# EAGLE design USB DigiVOX Interface (EAGLE 5.11)
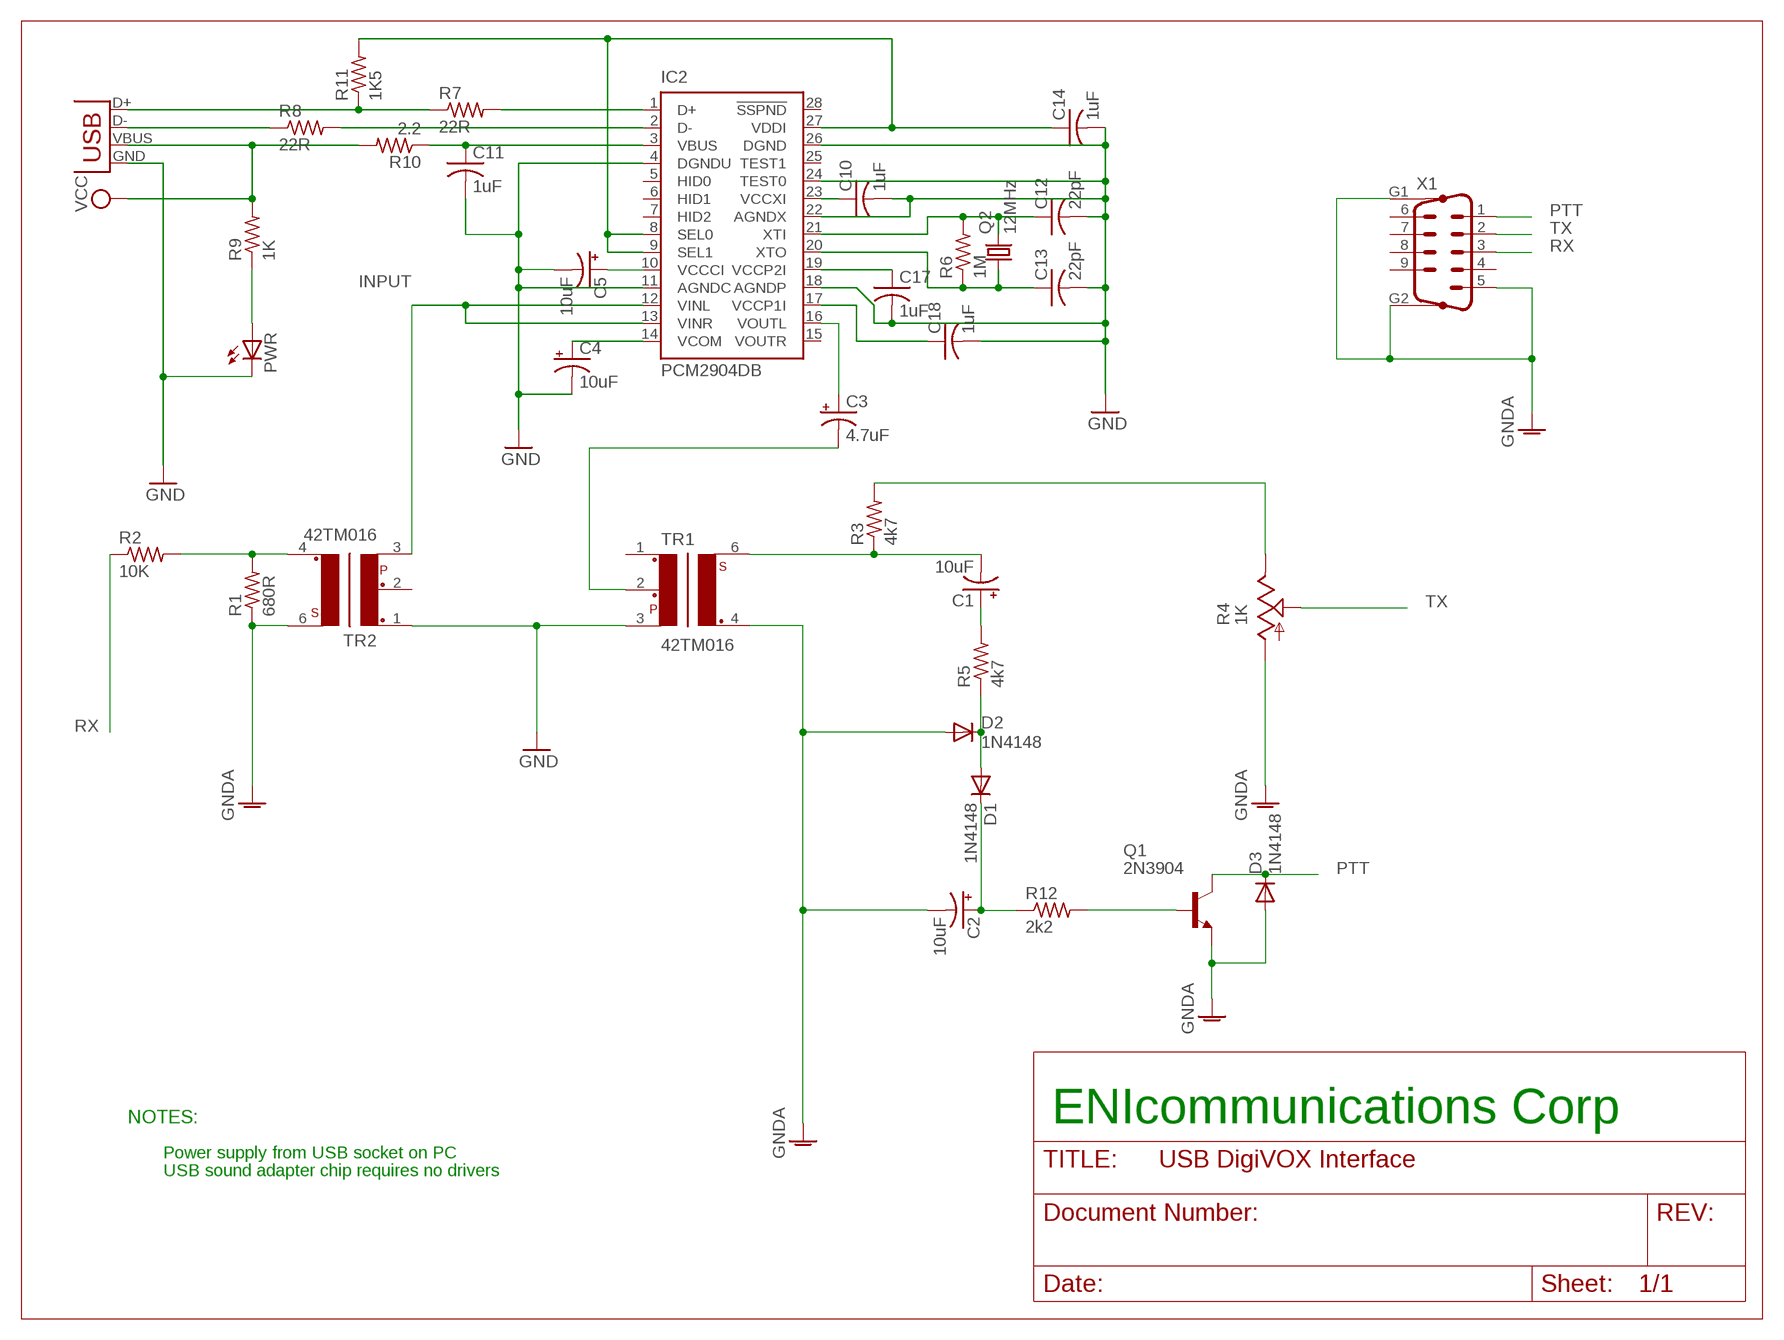
[diagram p0: schematic, sheet 1]

## Parts
C1  10uF  CAP_POLPTH2  [CPOL-RADIAL-10UF-25V]
C2  10uF  CAP_POLPTH2  [CPOL-RADIAL-10UF-25V]
C3  4.7uF  CAP_POLPTH2  [CPOL-RADIAL-10UF-25V]
C4  10uF  CAP_POLPTH2  [CPOL-RADIAL-10UF-25V]
C5  10uF  CAP_POLPTH2  [CPOL-RADIAL-10UF-25V]
C10  1uF  C-US025-025X050  [C025-025X050]
C11  1uF  C-US025-025X050  [C025-025X050]
C12  22pF  C-US025-025X050  [C025-025X050]
C13  22pF  C-US025-025X050  [C025-025X050]
C14  1uF  C-US025-025X050  [C025-025X050]
C17  1uF  C-US025-025X050  [C025-025X050]
C18  1uF  C-US025-025X050  [C025-025X050]
D1  1N4148  [DO35-10]
D2  1N4148  [DO35-10]
D3  1N4148  [DO35-10]
IC2  PCM2904DB  [SSOP28DB]
PWR  LED3MM  [LED3MM]
Q1  2N3904  [TO92]
Q2  12MHz  CRYSTALHC49S  [HC49/S]
R1  680R  R-US_0207/2V  [0207/2V]
R2  10K  R-US_0207/2V  [0207/2V]
R3  4k7  R-US_0207/2V  [0207/2V]
R4  1K  TRIM_US-CA6V  [CA6V]
R5  4k7  R-US_0207/2V  [0207/2V]
R6  1M  R-US_0207/2V  [0207/2V]
R7  22R  R-US_0207/2V  [0207/2V]
R8  22R  R-US_0207/2V  [0207/2V]
R9  1K  R-US_0207/2V  [0207/2V]
R10  2.2  R-US_0207/2V  [0207/2V]
R11  1K5  R-US_0207/2V  [0207/2V]
R12  2k2  R-US_0207/2V  [0207/2V]
TR1  42TM016  42TM113  [42TM]
TR2  42TM016  42TM113  [42TM]
X1  M09HP  [M09HP]
X2  USBSMD  [USB-MINIB]

## Nets
GND: C4.2(-) C5.2(-) C10.2 C11.2 C12.2 C13.2 C14.2 C17.2 C18.2 IC2.4(DGNDU) IC2.11(AGNDC) IC2.18(AGNDP) IC2.22(AGNDX) IC2.24(TEST0) IC2.26(DGND) PWR.K(C) TR1.3 TR2.1 X2.GND
GNDA: C2.2(-) D2.A D3.A Q1.3(E) R1.1 R4.A TR1.4 TR2.6 X1.5 X1.G1 X1.G2
INPUT: IC2.12(VINL) IC2.13(VINR) TR2.3
N$1: C3.1(+) IC2.16(VOUTL)
N$2: C1.2(-) R3.1 TR1.6
N$3: C5.1(+) IC2.10(VCCCI)
N$4: C12.1 IC2.21(XTI) Q2.2 R6.2
N$5: PWR.A R9.1
N$6: C13.1 IC2.20(XTO) Q2.1 R6.1
N$7: C10.1 IC2.23(VCCXI)
N$8: R1.2 R2.2 TR2.4
N$9: C4.1(+) IC2.14(VCOM)
N$11: C1.1(+) R5.2
N$12: D1.A D2.C R5.1
N$13: C14.1 IC2.8(SEL0) IC2.9(SEL1) IC2.27(VDDI) R11.2
N$14: C3.2(-) TR1.2
N$15: C11.1 IC2.3(VBUS) R10.1
N$16: Q1.2(B) R12.2
N$17: R3.2 R4.E
N$18: C17.1 IC2.19(VCCP2I)
N$19: R7.1 R11.1 X2.D+
N$20: IC2.2(D-) R8.2
N$21: IC2.1(D+) R7.2
N$22: R8.1 X2.D-
N$24: C2.1(+) D1.C R12.1
N$26: C18.1 IC2.17(VCCP1I)
PTT: D3.C Q1.1(C) X1.1
RX: R2.1 X1.3
TX: R4.S X1.2
VCC: R9.2 R10.2 X2.VBUS
Unconnected: IC2.5(HID0) IC2.6(HID1) IC2.7(HID2) IC2.15(VOUTR) IC2.25(TEST1) IC2.28(!SSPND) TR1.1 TR2.2 X1.4 X1.6 X1.7 X1.8 X1.9

## Notes on the sheet
- NOTES: | ENIcommunications Corp
- Power supply from USB socket on PC
- USB sound adapter chip requires no drivers

## Library data of the parts
C1-C5 = SparkFun:CAP_POL: Capacitor Polarized These are standard SMD and PTH capacitors. Normally 10uF, 47uF, and 100uF in electrolytic and tantalum varieties. Always verify the external diameter of the through hole cap, it varies with capacity, voltage, and manufacturer. The EIA devices should be standard.
C10-C14 C17 C18 = rcl:C-US: CAPACITOR, American symbol
D1-D3 = diode:1N4148: DIODE high speed (Philips)
IC2 = texas:PCM29*: STEREO AUDIO CODEC WITH USB INTERFACE SINGLE-ENDED ANALOG INPUT/OUTPUT AND S/PDIF
PWR = led:LED: LED OSRAM: - CHIPLED LG R971, LG N971, LY N971, LG Q971, LY Q971, LO R971, LY R971 LH N974, LH R974 LS Q976, LO Q976, LY Q976 LO Q996 - Hyper CHIPLED LW Q18S LB Q993, LB Q99A, LB R99A - SideLED LS A670, LO A670, LY A670, LG A670, LP A670 LB A673, LV A673, LT A673, LW A673 LH A674 LY A675 LS A676, LA A676, LO A676, LY A676, LW A676 LS A679, LY A679, LG A679 - Hyper Micro SIDELED® LS Y876, LA Y876, LO Y876, LY Y876 LT Y87S - SmartLED LW L88C, LW L88S LB L89C, LB L89S, LG L890 LS L89K, LO L89K, LY L89K LS L896, LA L896, LO L896, LY L896 - TOPLED LS T670, LO T670, LY T670, LG T670, LP T670 LSG T670, LSP T670, LSY T670, LOP T670, LYG T670 LG T671, LOG T671, LSG T671 LB T673, LV T673, LT T673, LW T673 LH T674 LS T676, LA T676, LO T676, LY T676, LB T676, LH T676, LSB T676, LW T676 LB T67C, LV T67C, LT T67C, LS T67K, LO T67K, LY T67K, LW E67C LS E67B, LA E67B, LO E67B, LY E67B, LB E67C, LV E67C, LT E67C LW T67C LS T679, LY T679, LG T679 LS T770, LO T770, LY T770, LG T770, LP T770 LB T773, LV T773, LT T773, LW T773 LH T774 LS E675, LA E675, LY E675, LS T675 LS T776, LA T776, LO T776, LY T776, LB T776 LHGB T686 LT T68C, LB T68C - Hyper Mini TOPLED® LB M676 - Mini TOPLED Santana® LG M470 LS M47K, LO M47K, LY M47K Source: http://www.osram.convergy.de LUXEON: - LUMILED® LXK2-PW12-R00, LXK2-PW12-S00, LXK2-PW14-U00, LXK2-PW14-V00 LXK2-PM12-R00, LXK2-PM12-S00, LXK2-PM14-U00 LXK2-PE12-Q00, LXK2-PE12-R00, LXK2-PE12-S00, LXK2-PE14-T00, LXK2-PE14-U00 LXK2-PB12-K00, LXK2-PB12-L00, LXK2-PB12-M00, LXK2-PB14-N00, LXK2-PB14-P00, LXK2-PB14-Q00 LXK2-PR12-L00, LXK2-PR12-M00, LXK2-PR14-Q00, LXK2-PR14-R00 LXK2-PD12-Q00, LXK2-PD12-R00, LXK2-PD12-S00 LXK2-PH12-R00, LXK2-PH12-S00 LXK2-PL12-P00, LXK2-PL12-Q00, LXK2-PL12-R00 Source: www.luxeon.com KINGBRIGHT: KA-3528ASYC Source: www.kingbright.com
Q1 = transistor-npn:2N3904: NPN Transistor
Q2 = crystal:CRYSTAL: CRYSTAL
R1-R3 R5-R12 = resistor:R-US_: RESISTOR, American symbol
R4 = pot:TRIM_US-: POTENTIOMETER
TR1 TR2 = trafo-xicon:42TM113: Transformer Mouser 42TLM Series Source: http://www.mouser.com/catalog/specsheets/164267.pdf
X1 = con-subd:M09HP: SUB-D
X2 = SparkFun:USB: USB Connectors USB-B-PTH is fully proven SKU : PRT-00139 USB-miniB is fully proven SKU : PRT-00587 USB-A-PCB is untested. USB-A-H is throughly reviewed, but untested. Spark Fun Electronics SKU : PRT-00437 USB-B-SMT is throughly reviewed, but untested. Needs silkscreen touching up. USB-A-S has not been used/tested USB-MB-H has not been used/tested

## Board
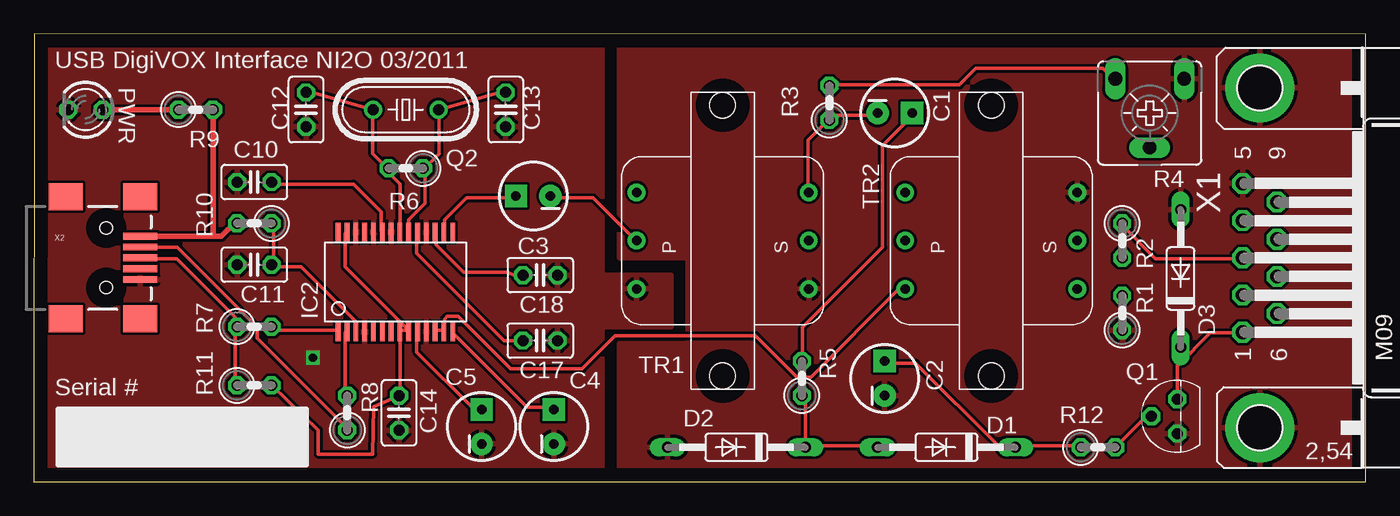
[diagram p1: board, top side]
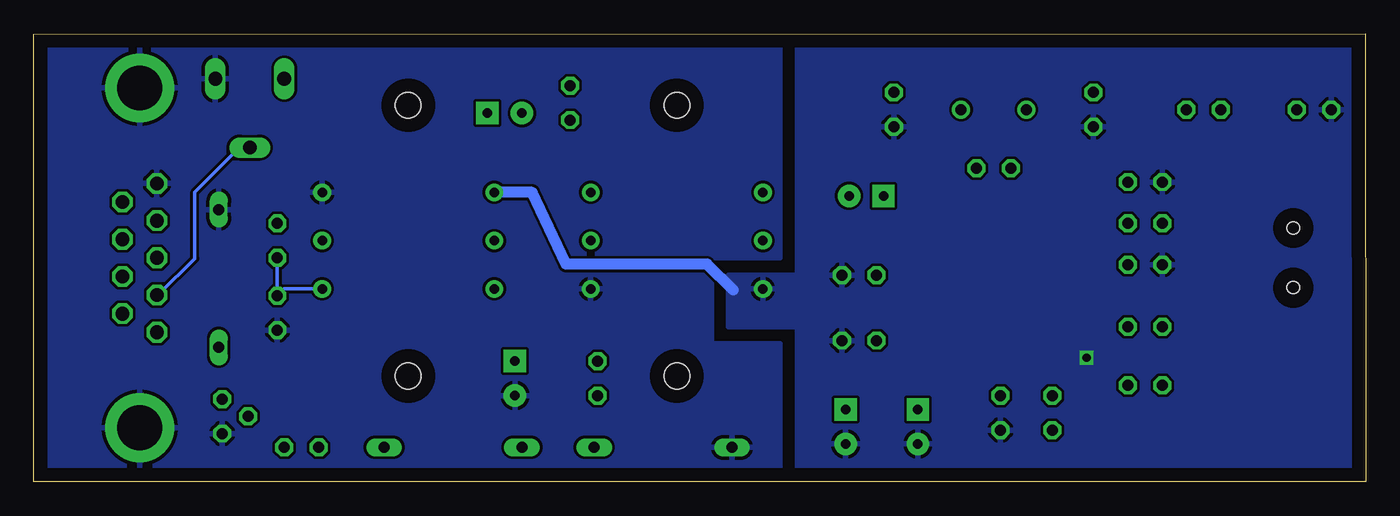
[diagram p2: board, bottom side, seen from below]

Size 98.22 x 33.02 mm. Coordinates in mm from the lower left corner, seen from the top.
Outline: 0,0 98.22,0 98.22,33.01 0.01,33.02 0,0
Copper layers (1*16): Top 0.035mm / dielectric 1.5mm / Bottom 0.035mm
Design rules "default": minimum track width 10mil, minimum drill 24mil, track to track 8mil, track to pad 8mil, pad to pad 8mil, via to via 8mil, smd to smd 8mil, copper to edge 40mil, drill to drill 8mil, minimum pad ring 10mil, minimum via ring 8mil, stop-mask expansion 4mil, vias tented up to drill 0mil, thermal gap 10mil

### Footprints (pad centres in the part's own frame; a part is rotated, then mirrored left to right if it is on the bottom)
CPOL-RADIAL-10UF-25V = drill 0.7 pad 1.651 square: 1 1.27,0 | drill 0.7 pad 1.651: 2 -1.27,0
C025-025X050 = drill 0.813 octagon: 1 -1.27,0; 2 1.27,0
DO35-10 = drill 0.813 long: A 5.08,0; C -5.08,0
SSOP28DB = smd 0.348 x 1.397: 1 -4.225,-3.656; 2 -3.575,-3.656; 3 -2.925,-3.656; 4 -2.275,-3.656; 5 -1.625,-3.656; 6 -0.975,-3.656; 7 -0.325,-3.656; 8 0.325,-3.656; 9 0.975,-3.656; 10 1.625,-3.656; 11 2.275,-3.656; 12 2.925,-3.656; 13 3.575,-3.656; 14 4.225,-3.656; 15 4.225,3.656; 16 3.575,3.656; 17 2.925,3.656; 18 2.275,3.656; 19 1.625,3.656; 20 0.975,3.656; 21 0.325,3.656; 22 -0.325,3.656; 23 -0.975,3.656; 24 -1.625,3.656; 25 -2.275,3.656; 26 -2.925,3.656; 27 -3.575,3.656; 28 -4.225,3.656
LED3MM = drill 0.813 octagon: A -1.27,0; K 1.27,0
TO92 = drill 0.813 octagon: 1 1.27,0; 2 0,1.905; 3 -1.27,0
HC49/S = drill 0.813: 1 -2.413,0; 2 2.413,0
0207/2V = drill 0.813 octagon: 1 -1.27,0; 2 1.27,0
CA6V = drill 1.016 long: A -2.54,-2.54; E 2.54,-2.54; S 0,2.54
42TM = drill 0.7 pad 1.3: 1 -3.556,-6.35; 2 0,-6.35; 3 3.556,-6.35; 4 3.556,6.35; 5 0,6.35; 6 -3.556,6.35 | hole 1.9: -9.982,0; 9.982,0
M09HP = drill 1.016 octagon: 1 -5.486,1.27; 2 -2.743,1.27; 3 0,1.27; 4 2.743,1.27; 5 5.486,1.27; 6 -4.115,-1.27; 7 -1.372,-1.27; 8 1.372,-1.27; 9 4.115,-1.27 | drill 3.302 pad 5.08: G1 -12.522,0; G2 12.522,0
USB-MINIB = smd 2.5 x 0.5: D+ 2.5,0; D- 2.5,0.8; GND 2.5,-1.6; ID 2.5,-0.8; VBUS 2.5,1.6 | smd 2.5 x 2: GND@1 -3,-4.5; GND@2 -3,4.5; GND@3 2.5,4.5; GND@4 2.5,-4.5 | hole 0.9: 0,2.2; 0,-2.2

### Placement (x,y rotation side)
C1  63.5,27.18 0 top
C2  62.74,7.62 90 top
C3  36.83,21.08 180 top
C4  38.35,4.06 90 top
C5  33.02,4.06 90 top
C10  16.26,22.1 180 top
C11  16.26,16 180 top
C12  20.07,27.43 270 top
C13  34.8,27.43 270 top
C14  26.92,5.08 270 top
C17  37.34,10.41 0 top
C18  37.34,15.24 0 top
D1  67.31,2.54 180 top
D2  51.82,2.54 180 top
D3  84.58,14.99 90 top
IC2  26.67,14.73 0 top
PWR  3.81,27.43 180 top
Q1  84.33,4.83 90 top
Q2  27.43,27.43 180 top
R1  80.26,12.45 90 top
R2  80.26,17.78 270 top
R3  58.67,27.94 90 top
R4  82.3,27.18 180 top
R5  56.64,7.62 90 top
R6  27.43,23.11 180 top
R7  16.26,11.43 0 top
R8  23.11,5.08 90 top
R9  11.94,27.43 0 top
R10  16.26,19.05 180 top
R11  16.26,7.11 0 top
R12  78.49,2.54 0 top
TR1  50.8,17.78 270 top
TR2  70.61,17.78 270 top
X1  90.42,16.51 90 top
X2  5.33,16.51 0 top

### Tracks (layer width: path | path; a pad name or v marks a point on that pad's centre or on a via)
GND  (via drill 0.6)
  Bottom 0.254: 46.99,14.63 46.63,14.12
  Bottom 0.813: 46.63,14.12 48.56,16.05 58.98,16.05 61.47,21.34 TR2.1
  other vias: 20.57,9.14
  pour Bottom: 0,0 41.91,0 41.91,11.43 46.99,11.43 46.99,15.24 41.91,15.24 41.91,33.02 0,33.02
  pour Top: 0,0 41.91,0 41.91,11.43 46.99,11.43 46.99,15.24 41.91,15.24 41.91,33.02 0,33.02
GNDA
  pour Bottom: 43.18,0 43.18,10.16 48.26,10.16 48.26,16.51 43.18,16.51 43.18,33.02 98.3,33.02 98.3,0
  pour Top: 43.18,0 43.18,10.16 48.26,10.16 48.26,16.51 43.18,16.51 43.18,33.02 98.3,33.02 98.3,0
INPUT
  Top 0.254: IC2.12 29.67,11.18 30.07,11.18 IC2.13 30.28,11.18 30.28,11.99 30.48,12.19 31.29,12.19 35.15,8.33 40.44,8.33 42.88,10.77 53.24,10.77 56.29,7.72 57.3,7.72 63.8,14.22 TR2.3
N$1
  Top 0.254: IC2.16 30.28,18.49 30.28,19.3 31.9,20.93 35.56,20.93 C3.1
N$2
  Top 0.254: TR1.6 57.1,21.34 57.1,25.2 58.52,26.62 R3.1 58.73,26.82 58.93,27.03 62.18,27.03 C1.2
N$3
  Top 0.254: IC2.10 28.25,10.97 28.25,9.55 32.31,5.49 32.92,5.49 C5.1
N$4
  Top 0.254: IC2.21 27.03,18.49 27.03,21.95 26.01,22.96 R6.2 26.01,23.16 24.99,24.18 24.99,27.43 | 24.99,27.43 Q2.2 | 24.99,27.43 20.73,28.65 20.12,28.65 C12.1
N$5
  Top 0.406: PWR.A R9.1
N$6
  Top 0.254: IC2.20 27.64,18.49 27.64,19.3 28.85,20.52 28.85,22.96 R6.1 28.85,23.16 29.87,24.18 29.87,27.43 | 29.87,27.43 Q2.1 | 29.87,27.43 34.14,28.65 34.75,28.65 C13.1
N$7
  Top 0.254: IC2.23 25.6,18.49 25.6,19.91 23.57,21.95 17.68,21.95 C10.1
N$8
  Bottom 0.254: R2.2 R1.2 79.76,14.22 TR2.4
N$9
  Top 0.254: IC2.14 30.89,10.97 36.37,5.49 38.2,5.49 C4.1
N$11
  Top 0.254: R5.2 56.69,8.94 56.69,11.38 62.59,17.27 62.59,24.79 64.82,27.03 C1.1
N$12
  Top 0.254: 56.9,2.64 56.9,6.1 R5.1 | 56.9,2.64 62.18,2.64 D1.A | D2.C 56.9,2.64
N$13
  Top 0.254: 27.64,11.18 27.03,11.18 IC2.8 27.03,10.97 27.03,6.5 C14.1 25.04,5.54 24.99,2.03 20.98,2.03 20.98,3.81 R11.2 | 27.64,11.18 22.96,15.85 22.96,18.29 IC2.27 | 27.64,11.18 IC2.9
N$14
  Top 0.254: TR1.2 44.3,17.88 41.25,20.93 38.2,20.93 C3.2
N$15
  Top 0.254: IC2.3 23.77,11.18 23.77,11.79 19.71,15.85 17.68,15.85 C11.1 17.68,16.05 17.68,18.9 R10.1
N$16
  Top 0.254: R12.2 81.89,4.67 82.3,4.67 Q1.2
N$17
  Top 0.254: R3.2 58.73,29.26 68.28,29.26 69.49,30.48 78.84,30.48 79.65,29.67 R4.E
N$18
  Top 0.254: IC2.19 28.25,18.29 28.25,16.87 34.7,10.41 C17.1
N$19
  Top 0.254: 14.83,12.14 10.52,16.46 7.92,16.46 X2.D+ | 14.83,12.14 14.83,7.11 R11.1 | 14.83,12.14 R7.1
N$20
  Top 0.254: IC2.2 22.96,10.97 22.96,6.5 R8.2
N$21
  Top 0.254: IC2.1 22.35,11.18 17.88,11.18 17.68,11.38 R7.2
N$22
  Top 0.254: X2.D- 7.92,17.27 10.57,17.27 16.46,11.38 16.46,10.57 23.16,3.86 R8.1
N$24
  Top 0.254: R12.1 77.22,2.64 72.54,2.64 D1.C 72.34,2.64 71.12,2.64 65.02,8.74 62.79,8.74 C2.1
N$26
  Top 0.254: IC2.17 29.67,18.29 29.67,17.48 31.7,15.44 34.95,15.44 35.41,15.24 C18.1
PTT
  Top 0.254: 84.33,8.53 84.33,9.55 84.53,9.75 D3.C | Q1.1 84.33,8.53 | 84.33,8.53 86.77,10.97 89,10.97 X1.1
RX
  Top 0.254: R2.1 80.26,18.9 82.7,16.46 89,16.46 X1.3
TX
  Bottom 0.254: X1.2 89,13.82 86.36,16.46 86.36,21.34 83.11,24.59 82.3,24.59 R4.S
VCC
  Top 0.254: X2.VBUS 7.92,18.09 | 14.83,19.1 R10.2
  Top 0.406: 13.21,18.09 13.82,18.09 14.83,19.1 | 7.92,18.09 13.21,18.09 | 13.21,18.09 R9.2

### Text on the board
tNames: USB DigiVOX Interface NI2O 03/2011 | Serial #